# Altium schematic sheet ports.SchDoc
size A4
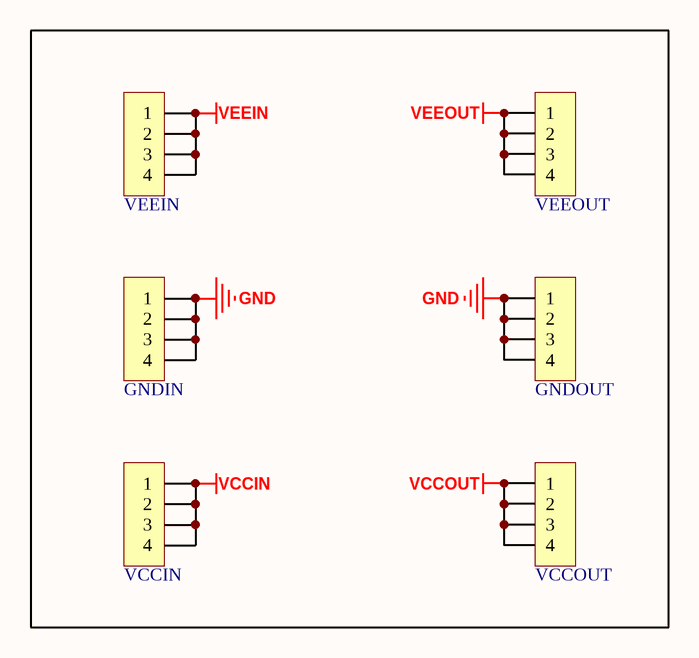
[diagram p0: ports.SchDoc]

## Parts
GNDIN  HDR-1X4  [HDR2.54-LI-4P]  (value not drawn)
GNDOUT  HDR-1X4  [HDR2.54-LI-4P]  (value not drawn)
VCCIN  HDR-1X4  [HDR2.54-LI-4P]  (value not drawn)
VCCOUT  HDR-1X4  [HDR2.54-LI-4P]  (value not drawn)
VEEIN  HDR-1X4  [HDR2.54-LI-4P]  (value not drawn)
VEEOUT  HDR-1X4  [HDR2.54-LI-4P]  (value not drawn)

## Nets
GND: GNDIN.1 GNDIN.2 GNDIN.3 GNDIN.4 GNDOUT.1 GNDOUT.2 GNDOUT.3 GNDOUT.4
VCCIN: VCCIN.1 VCCIN.2 VCCIN.3 VCCIN.4
VCCOUT: VCCOUT.1 VCCOUT.2 VCCOUT.3 VCCOUT.4
VEEIN: VEEIN.1 VEEIN.2 VEEIN.3 VEEIN.4
VEEOUT: VEEOUT.1 VEEOUT.2 VEEOUT.3 VEEOUT.4

## Library data of the parts
GNDIN GNDOUT VCCIN VCCOUT VEEIN VEEOUT = Header 4: 4P接插件; 版权归属: 源创客; BOM名称: 4P接插件; 学习资源: www.ooocke.com